# Altium schematic sheet _microcontroller.SchDoc
size Tabloid
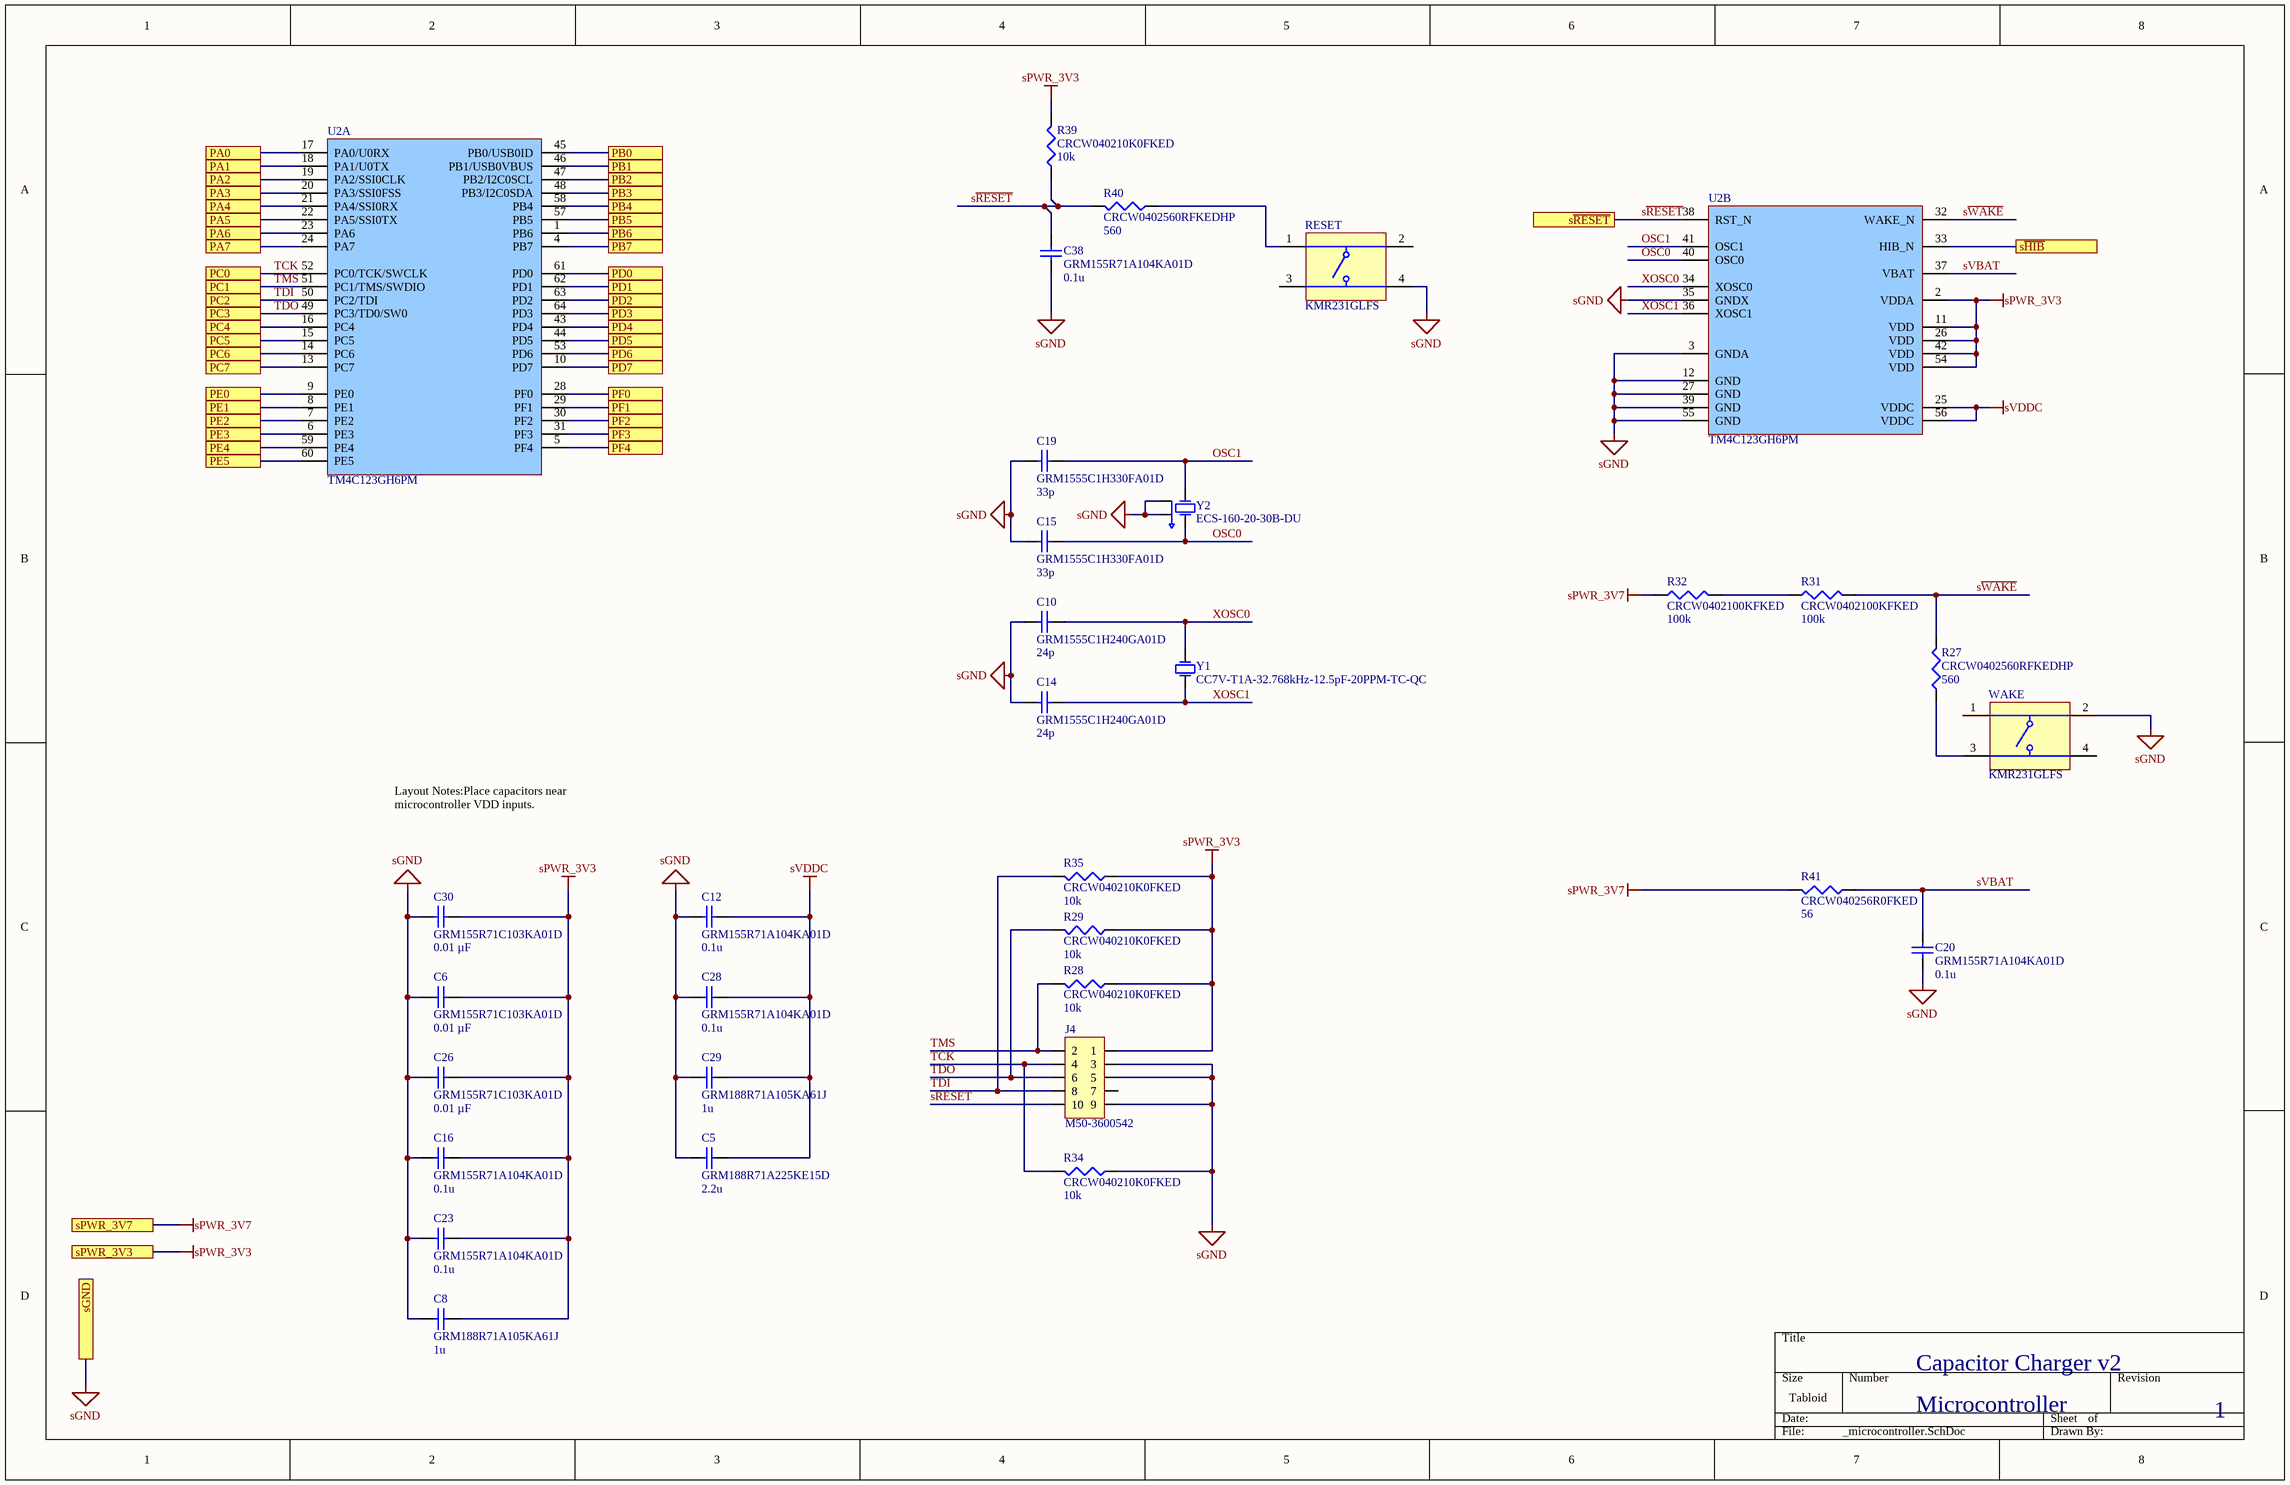
[diagram p0: _microcontroller.SchDoc]

## Parts
C5  GRM188R71A225KE15D  value 2.2u  [0603]
C6  GRM155R71C103KA01D  value 0.01 µF  [0402]
C8  GRM188R71A105KA61J  value 1u  [0603]
C10  GRM1555C1H240GA01D  value 24p  [0402]
C12  GRM155R71A104KA01D  value 0.1u  [0402]
C14  GRM1555C1H240GA01D  value 24p  [0402]
C15  GRM1555C1H330FA01D  value 33p  [0402]
C16  GRM155R71A104KA01D  value 0.1u  [0402]
C19  GRM1555C1H330FA01D  value 33p  [0402]
C20  GRM155R71A104KA01D  value 0.1u  [0402]
C23  GRM155R71A104KA01D  value 0.1u  [0402]
C26  GRM155R71C103KA01D  value 0.01 µF  [0402]
C28  GRM155R71A104KA01D  value 0.1u  [0402]
C29  GRM188R71A105KA61J  value 1u  [0603]
C30  GRM155R71C103KA01D  value 0.01 µF  [0402]
C38  GRM155R71A104KA01D  value 0.1u  [0402]
J4  M50-3600542  [M50-3600542]
R27  CRCW0402560RFKEDHP  value 560  [0402]
R28  CRCW040210K0FKED  value 10k  [0402]
R29  CRCW040210K0FKED  value 10k  [0402]
R31  CRCW0402100KFKED  value 100k  [0402]
R32  CRCW0402100KFKED  value 100k  [0402]
R34  CRCW040210K0FKED  value 10k  [0402]
R35  CRCW040210K0FKED  value 10k  [0402]
R39  CRCW040210K0FKED  value 10k  [0402]
R40  CRCW0402560RFKEDHP  value 560  [0402]
R41  CRCW040256R0FKED  value 56  [0402]
RESET  KMR231GLFS  [KMR231GLFS]
U2  TM4C123GH6PM  [QFP50P1200X1200X160-64N]  (parts A,B of 2)
WAKE  KMR231GLFS  [KMR231GLFS]
Y1  CC7V-T1A-32.768kHz-12.5pF-20PPM-TC-QC  [CC7V-T1A]
Y2  ECS-160-20-30B-DU  [ECX-53B]

## Ports
PA0, PA1, PA2, PA3, PA4, PA5, PA6, PA7, PB0, PB1, PB2, PB3, PB4, PB5, PB6, PB7, PC0, PC1, PC2, PC3, PC4, PC5, PC6, PC7, PD0, PD1, PD2, PD3, PD4, PD5, PD6, PD7, PE0, PE1, PE2, PE3, PE4, PE5, PF0, PF1, PF2, PF3, PF4, sGND, sPWR_3V3, sPWR_3V7, s~{HIB}, s~{RESET}

## Nets
sGND: C5.2 C6.2 C8.2 C10.1 C12.2 C14.1 C15.1 C16.2 C19.1 C20.2 C23.2 C26.2 C28.2 C29.2 C30.2 C38.2 J4.3 J4.5 J4.9 R34.1 RESET.4 U2.3(GNDA) U2.12(GND) U2.27(GND) U2.35(GNDX) U2.39(GND) U2.55(GND) WAKE.2 Y2.2 Y2.4 ; port sGND
sPWR_3V3: C6.1 C8.1 C16.1 C23.1 C26.1 C30.1 J4.1 R28.1 R29.1 R35.1 R39.2 U2.2(VDDA) U2.11(VDD) U2.26(VDD) U2.42(VDD) U2.54(VDD) ; port sPWR_3V3
sPWR_3V7: R32.1 R41.2 ; port sPWR_3V7
sVDDC: C5.1 C12.1 C28.1 C29.1 U2.25(VDDC) U2.56(VDDC)
OSC0: C15.2 U2.40(OSC0) Y2.3
OSC1: C19.2 U2.41(OSC1) Y2.1
PA0: U2.17(PA0/U0RX) ; port PA0
PA1: U2.18(PA1/U0TX) ; port PA1
PA2: U2.19(PA2/SSI0CLK) ; port PA2
PA3: U2.20(PA3/SSI0FSS) ; port PA3
PA4: U2.21(PA4/SSI0RX) ; port PA4
PA5: U2.22(PA5/SSI0TX) ; port PA5
PA6: U2.23(PA6) ; port PA6
PA7: U2.24(PA7) ; port PA7
PB0: U2.45(PB0/USB0ID) ; port PB0
PB1: U2.46(PB1/USB0VBUS) ; port PB1
PB2: U2.47(PB2/I2C0SCL) ; port PB2
PB3: U2.48(PB3/I2C0SDA) ; port PB3
PB4: U2.58(PB4) ; port PB4
PB5: U2.57(PB5) ; port PB5
PB6: U2.1(PB6) ; port PB6
PB7: U2.4(PB7) ; port PB7
PC4: U2.16(PC4) ; port PC4
PC5: U2.15(PC5) ; port PC5
PC6: U2.14(PC6) ; port PC6
PC7: U2.13(PC7) ; port PC7
PD0: U2.61(PD0) ; port PD0
PD1: U2.62(PD1) ; port PD1
PD2: U2.63(PD2) ; port PD2
PD3: U2.64(PD3) ; port PD3
PD4: U2.43(PD4) ; port PD4
PD5: U2.44(PD5) ; port PD5
PD6: U2.53(PD6) ; port PD6
PD7: U2.10(PD7) ; port PD7
PE0: U2.9(PE0) ; port PE0
PE1: U2.8(PE1) ; port PE1
PE2: U2.7(PE2) ; port PE2
PE3: U2.6(PE3) ; port PE3
PE4: U2.59(PE4) ; port PE4
PE5: U2.60(PE5) ; port PE5
PF0: U2.28(PF0) ; port PF0
PF1: U2.29(PF1) ; port PF1
PF2: U2.30(PF2) ; port PF2
PF3: U2.31(PF3) ; port PF3
PF4: U2.5(PF4) ; port PF4
s~{HIB}: U2.33(HIB_N) ; port s~{HIB}
s~{RESET}: C38.1 J4.10 R39.1 R40.2 U2.38(RST_N) ; port s~{RESET}
sVBAT: C20.1 R41.1 U2.37(VBAT)
s~{WAKE}: R27.2 R31.2 U2.32(WAKE_N)
TCK: J4.4 R34.2 U2.52(PC0/TCK/SWCLK) ; port PC0
TDI: J4.8 R35.2 U2.50(PC2/TDI) ; port PC2
TDO: J4.6 R29.2 U2.49(PC3/TD0/SW0) ; port PC3
TMS: J4.2 R28.2 U2.51(PC1/TMS/SWDIO) ; port PC1
XOSC0: C10.2 U2.34(XOSC0) Y1.1
XOSC1: C14.2 U2.36(XOSC1) Y1.2
NetR27_1: R27.1 WAKE.3
NetR31_1: R31.1 R32.2
NetR40_1: R40.1 RESET.1

Not connected (* = marked no-connect by the designer): J4 7; RESET 2 3; WAKE 1 4

## Notes on the sheet
- Layout Notes:Place capacitors near microcontroller VDD inputs.
- Capacitor Charger v2
- Microcontroller
- 1

## Library data of the parts
C5 C8 C29 = GRM188R71AxxxKdddd: -55-125C, 1608, 10V, X7R, ±10%
C6 C26 C30 = Cap: Cap, 0.01 µF, 16 V, X7R; Published: 8-Jun-2000; LatestRevisionDate: 17-Jul-2002; LatestRevisionNote: Re-released for DXP Platform.; PackageReference: RAD-0.3; Publisher: Altium Limited; PackageDescription: Radial Cap, Thru-Hole; 2 Leads; 0.3 in Pin Spacing
C10 C14 C15 C19 = Cap Semi: Capacitor (Semiconductor SIM Model); Published: 8-Jun-2000; LatestRevisionDate: 29-May-2009; LatestRevisionNote: IPC-7351 Footprint Added.; PackageReference: C1206; Publisher: Altium Limited; PackageDescription: Chip Capacitor
C12 C16 C20 C23 C28 C38 = GRM155R71AxxxKdddd: -55-125C, 1005, 10V, X7R, ±10%
R27-R29 R31 R32 R34 R35 R39-R41 = CRCW0402xxxxFKED: 0.125W, -55-155C, 1005, 50V, ±1%
RESET WAKE = KMR231GLFS: Switch Tactile, SPST, 50 mA, 32 V, -40 to 85 degC, 4-Pin SMD, RoHS, Tape and Reel; Manufacturer: C&K Components; Mechanical Life: 150000Cycles; Switch Configuration: N.O.; Actuator Style: Button; Ground Terminal: Yes; Maximum DC Voltage Rating: 32V; Minimum Insulation Resistance: >=1000MOhm; Dielectric Strength: >=250Vrms; Operating Force: 3N; Illumination Type: N/R; Body Orientation: Straight; Contact Rating @ Voltage: 1A; Actuator Length: 0.5mm; Operating Temperature: -40to85C; Electrical Life: N/A; Housing Material: N/A; ECCN: EAR99; Pole Throw Configuration: SPST; Contact Plating: Silver; Dimension: 2.8x4.6x1.9mm; Type: Micro-Miniature; Product Weight: N/A; Package Description: 4-Pin Surface Mount Device, Body 4.6 x 2.8 mm; Actuator Color: N/A; HTS: 8536501199; Mounting Technology: SurfaceMount; Mounting: SurfaceMount,GullWing; Seal Location: N/A; Base Material: N/A; Family: KMR2; Part No: KMR231GLFS; Datasheet Version: 06/2016; Contact Material: Silver; Package Reference: KMR231GLFS; Manufacturer URL: http://www.ckswitches.com/; Maximum AC Voltage Rating: N/A; Datasheet URL: http://www.ck-components.com/media/1479/kmr2.pdf; RoHS: Yes; Seal Description: N/A; Packaging: TapeandReel; Supplier: C&KComponents
U2 = TM4C123GH6PM: Tiva TM4C123GH6PM Microcontroller
Y1 = CC7V-T1A: Crystals 32.768 kHz 12.5 pF +/-20 PPM -55/+125C
Y2 = ECS-160-20-30B-DU: Crystal, 16.000MHz, 20pF, 100ppm, -55 to 125 C, 60 Ω